# EAGLE design schematic (EAGLE 6.3)
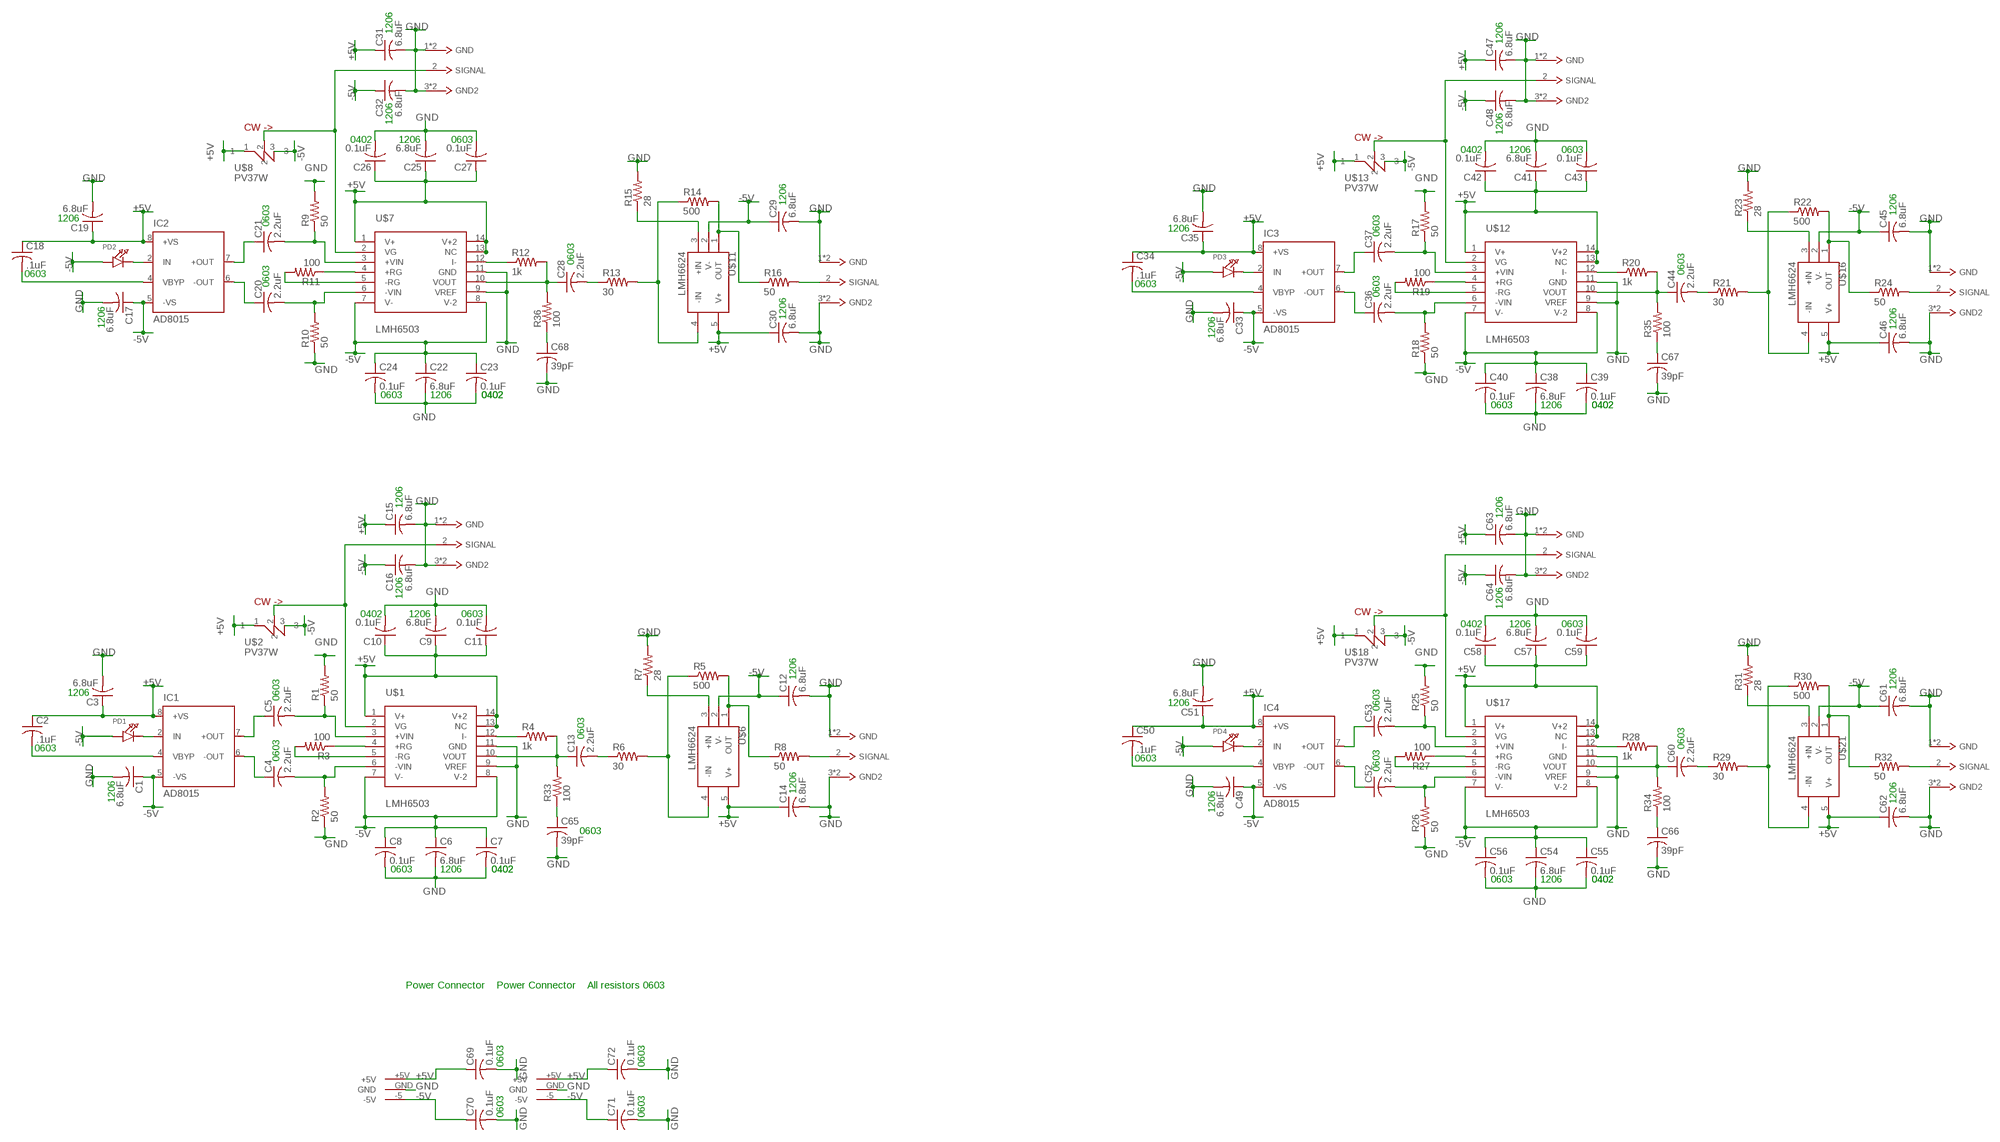
[diagram p0: schematic, sheet 1]

## Parts
C1  6.8uF  C-USC1206  [C1206]
C2  .1uF  C-USC0603  [C0603]
C3  6.8uF  C-USC1206  [C1206]
C4  2.2uF  C-USC0603  [C0603]
C5  2.2uF  C-USC0603  [C0603]
C6  6.8uF  C-USC1206  [C1206]
C7  0.1uF  C-USC0402  [C0402]
C8  0.1uF  C-USC0603  [C0603]
C9  6.8uF  C-USC1206  [C1206]
C10  0.1uF  C-USC0402  [C0402]
C11  0.1uF  C-USC0603  [C0603]
C12  6.8uF  C-USC1206  [C1206]
C13  2.2uF  C-USC0603  [C0603]
C14  6.8uF  C-USC1206  [C1206]
C15  6.8uF  C-USC1206  [C1206]
C16  6.8uF  C-USC1206  [C1206]
C17  6.8uF  C-USC1206  [C1206]
C18  .1uF  C-USC0603  [C0603]
C19  6.8uF  C-USC1206  [C1206]
C20  2.2uF  C-USC0603  [C0603]
C21  2.2uF  C-USC0603  [C0603]
C22  6.8uF  C-USC1206  [C1206]
C23  0.1uF  C-USC0402  [C0402]
C24  0.1uF  C-USC0603  [C0603]
C25  6.8uF  C-USC1206  [C1206]
C26  0.1uF  C-USC0402  [C0402]
C27  0.1uF  C-USC0603  [C0603]
C28  2.2uF  C-USC0603  [C0603]
C29  6.8uF  C-USC1206  [C1206]
C30  6.8uF  C-USC1206  [C1206]
C31  6.8uF  C-USC1206  [C1206]
C32  6.8uF  C-USC1206  [C1206]
C33  6.8uF  C-USC1206  [C1206]
C34  .1uF  C-USC0603  [C0603]
C35  6.8uF  C-USC1206  [C1206]
C36  2.2uF  C-USC0603  [C0603]
C37  2.2uF  C-USC0603  [C0603]
C38  6.8uF  C-USC1206  [C1206]
C39  0.1uF  C-USC0402  [C0402]
C40  0.1uF  C-USC0603  [C0603]
C41  6.8uF  C-USC1206  [C1206]
C42  0.1uF  C-USC0402  [C0402]
C43  0.1uF  C-USC0603  [C0603]
C44  2.2uF  C-USC0603  [C0603]
C45  6.8uF  C-USC1206  [C1206]
C46  6.8uF  C-USC1206  [C1206]
C47  6.8uF  C-USC1206  [C1206]
C48  6.8uF  C-USC1206  [C1206]
C49  6.8uF  C-USC1206  [C1206]
C50  .1uF  C-USC0603  [C0603]
C51  6.8uF  C-USC1206  [C1206]
C52  2.2uF  C-USC0603  [C0603]
C53  2.2uF  C-USC0603  [C0603]
C54  6.8uF  C-USC1206  [C1206]
C55  0.1uF  C-USC0402  [C0402]
C56  0.1uF  C-USC0603  [C0603]
C57  6.8uF  C-USC1206  [C1206]
C58  0.1uF  C-USC0402  [C0402]
C59  0.1uF  C-USC0603  [C0603]
C60  2.2uF  C-USC0603  [C0603]
C61  6.8uF  C-USC1206  [C1206]
C62  6.8uF  C-USC1206  [C1206]
C63  6.8uF  C-USC1206  [C1206]
C64  6.8uF  C-USC1206  [C1206]
C65  39pF  C-USC0603  [C0603]
C66  39pF  C-USC0603  [C0603]
C67  39pF  C-USC0603  [C0603]
C68  39pF  C-USC0603  [C0603]
C69  0.1uF  C-USC0402  [C0402]
C70  0.1uF  C-USC0402  [C0402]
C71  0.1uF  C-USC0402  [C0402]
C72  0.1uF  C-USC0402  [C0402]
IC1  AD8015  [SO8]
IC2  AD8015  [SO8]
IC3  AD8015  [SO8]
IC4  AD8015  [SO8]
PD1  LED1206  [CHIPLED_1206]
PD2  LED1206  [CHIPLED_1206]
PD3  LED1206  [CHIPLED_1206]
PD4  LED1206  [CHIPLED_1206]
R1  50  R-US_R0603  [R0603]
R2  50  R-US_R0603  [R0603]
R3  100  R-US_R0603  [R0603]
R4  1k  R-US_R0603  [R0603]
R5  500  R-US_R0603  [R0603]
R6  30  R-US_R0603  [R0603]
R7  28  R-US_R0603  [R0603]
R8  50  R-US_R0603  [R0603]
R9  50  R-US_R0603  [R0603]
R10  50  R-US_R0603  [R0603]
R11  100  R-US_R0603  [R0603]
R12  1k  R-US_R0603  [R0603]
R13  30  R-US_R0603  [R0603]
R14  500  R-US_R0603  [R0603]
R15  28  R-US_R0603  [R0603]
R16  50  R-US_R0603  [R0603]
R17  50  R-US_R0603  [R0603]
R18  50  R-US_R0603  [R0603]
R19  100  R-US_R0603  [R0603]
R20  1k  R-US_R0603  [R0603]
R21  30  R-US_R0603  [R0603]
R22  500  R-US_R0603  [R0603]
R23  28  R-US_R0603  [R0603]
R24  50  R-US_R0603  [R0603]
R25  50  R-US_R0603  [R0603]
R26  50  R-US_R0603  [R0603]
R27  100  R-US_R0603  [R0603]
R28  1k  R-US_R0603  [R0603]
R29  30  R-US_R0603  [R0603]
R30  500  R-US_R0603  [R0603]
R31  28  R-US_R0603  [R0603]
R32  50  R-US_R0603  [R0603]
R33  100  R-US_R0603  [R0603]
R34  100  R-US_R0603  [R0603]
R35  100  R-US_R0603  [R0603]
R36  100  R-US_R0603  [R0603]
U$1  LMH6503  [SOIC14]
U$2  PV37W  [PV37W]
U$3  DIVERSITYPWR  [DIVERSITYPOWER]
U$4  BNCCONN  [BNCPADS]
U$5  BNCCONN  [BNCPADS]
U$6  LMH6624  [SOT-23]
U$7  LMH6503  [SOIC14]
U$8  PV37W  [PV37W]
U$9  BNCCONN  [BNCPADS]
U$10  BNCCONN  [BNCPADS]
U$11  LMH6624  [SOT-23]
U$12  LMH6503  [SOIC14]
U$13  PV37W  [PV37W]
U$14  BNCCONN  [BNCPADS]
U$15  BNCCONN  [BNCPADS]
U$16  LMH6624  [SOT-23]
U$17  LMH6503  [SOIC14]
U$18  PV37W  [PV37W]
U$19  BNCCONN  [BNCPADS]
U$20  BNCCONN  [BNCPADS]
U$21  LMH6624  [SOT-23]
U$22  DIVERSITYPWR  [DIVERSITYPOWER]

## Nets
+5V: C2.1 C3.1 C9.1 C10.1 C11.1 C14.1 C15.1 C18.1 C19.1 C25.1 C26.1 C27.1 C30.1 C31.1 C34.1 C35.1 C41.1 C42.1 C43.1 C46.1 C47.1 C50.1 C51.1 C57.1 C58.1 C59.1 C62.1 C63.1 C69.1 C72.1 IC1.8(+VS) IC2.8(+VS) IC3.8(+VS) IC4.8(+VS) U$1.1(V+) U$1.13(NC) U$1.14(V+2) U$2.1 U$3.+5V U$6.5(V+) U$7.1(V+) U$7.13(NC) U$7.14(V+2) U$8.1 U$11.5(V+) U$12.1(V+) U$12.13(NC) U$12.14(V+2) U$13.1 U$16.5(V+) U$17.1(V+) U$17.13(NC) U$17.14(V+2) U$18.1 U$21.5(V+) U$22.+5V
-5V: C1.1 C6.1 C7.1 C8.1 C12.1 C16.1 C17.1 C22.1 C23.1 C24.1 C29.1 C32.1 C33.1 C38.1 C39.1 C40.1 C45.1 C48.1 C49.1 C54.1 C55.1 C56.1 C61.1 C64.1 C70.1 C71.1 IC1.5(-VS) IC2.5(-VS) IC3.5(-VS) IC4.5(-VS) PD1.A PD2.A PD3.A PD4.A U$1.7(V-) U$1.8(V-2) U$2.3 U$3.-5(-5V) U$6.2(V-) U$7.7(V-) U$7.8(V-2) U$8.3 U$11.2(V-) U$12.7(V-) U$12.8(V-2) U$13.3 U$16.2(V-) U$17.7(V-) U$17.8(V-2) U$18.3 U$21.2(V-) U$22.-5(-5V)
GND: C1.2 C3.2 C6.2 C7.2 C8.2 C9.2 C10.2 C11.2 C12.2 C14.2 C15.2 C16.2 C17.2 C19.2 C22.2 C23.2 C24.2 C25.2 C26.2 C27.2 C29.2 C30.2 C31.2 C32.2 C33.2 C35.2 C38.2 C39.2 C40.2 C41.2 C42.2 C43.2 C45.2 C46.2 C47.2 C48.2 C49.2 C51.2 C54.2 C55.2 C56.2 C57.2 C58.2 C59.2 C61.2 C62.2 C63.2 C64.2 C65.2 C66.2 C67.2 C68.2 C69.2 C70.2 C71.2 C72.2 R1.2 R2.1 R7.2 R9.2 R10.1 R15.2 R17.2 R18.1 R23.2 R25.2 R26.1 R31.2 U$1.9(VREF) U$1.11(GND) U$3.GND U$4.1(GND) U$4.3(GND2) U$4.4(GND) U$4.5(GND2) U$5.1(GND) U$5.3(GND2) U$5.4(GND) U$5.5(GND2) U$7.9(VREF) U$7.11(GND) U$9.1(GND) U$9.3(GND2) U$9.4(GND) U$9.5(GND2) U$10.1(GND) U$10.3(GND2) U$10.4(GND) U$10.5(GND2) U$12.9(VREF) U$12.11(GND) U$14.1(GND) U$14.3(GND2) U$14.4(GND) U$14.5(GND2) U$15.1(GND) U$15.3(GND2) U$15.4(GND) U$15.5(GND2) U$17.9(VREF) U$17.11(GND) U$19.1(GND) U$19.3(GND2) U$19.4(GND) U$19.5(GND2) U$20.1(GND) U$20.3(GND2) U$20.4(GND) U$20.5(GND2) U$22.GND
N$1: IC1.2(IN) PD1.C
N$2: C5.1 IC1.7(+OUT)
N$3: C2.2 IC1.4(VBYP)
N$4: C4.1 IC1.6(-OUT)
N$5: C4.2 R2.2 U$1.6(-VIN)
N$6: C5.2 R1.1 U$1.3(+VIN)
N$7: R3.1 U$1.4(+RG)
N$8: R3.2 U$1.5(-RG)
N$9: R4.1 U$1.12(I-)
N$10: C13.1 R4.2 R33.2 U$1.10(VOUT)
N$11: R5.1 R6.2 U$6.4(-IN)
N$12: C13.2 R6.1
N$13: U$1.2(VG) U$2.2 U$4.2(SIGNAL)
N$14: R8.2 U$5.2(SIGNAL)
N$15: R7.1 U$6.3(+IN)
N$16: R5.2 R8.1 U$6.1(OUT)
N$25: C18.2 IC2.4(VBYP)
N$26: IC2.2(IN) PD2.C
N$27: C21.1 IC2.7(+OUT)
N$28: C20.1 IC2.6(-OUT)
N$29: C20.2 R10.2 U$7.6(-VIN)
N$30: C21.2 R9.1 U$7.3(+VIN)
N$31: R11.1 U$7.4(+RG)
N$32: R11.2 U$7.5(-RG)
N$33: R12.1 U$7.12(I-)
N$34: C28.1 R12.2 R36.2 U$7.10(VOUT)
N$35: C28.2 R13.1
N$36: U$7.2(VG) U$8.2 U$9.2(SIGNAL)
N$37: R13.2 R14.1 U$11.4(-IN)
N$38: R15.1 U$11.3(+IN)
N$39: R14.2 R16.1 U$11.1(OUT)
N$40: R16.2 U$10.2(SIGNAL)
N$47: C34.2 IC3.4(VBYP)
N$48: IC3.2(IN) PD3.C
N$49: C37.1 IC3.7(+OUT)
N$50: C36.1 IC3.6(-OUT)
N$51: C36.2 R18.2 U$12.6(-VIN)
N$52: C37.2 R17.1 U$12.3(+VIN)
N$53: R19.1 U$12.4(+RG)
N$54: R19.2 U$12.5(-RG)
N$55: R20.1 U$12.12(I-)
N$56: C44.1 R20.2 R35.2 U$12.10(VOUT)
N$57: C44.2 R21.1
N$58: U$12.2(VG) U$13.2 U$14.2(SIGNAL)
N$59: R21.2 R22.1 U$16.4(-IN)
N$60: R23.1 U$16.3(+IN)
N$61: R22.2 R24.1 U$16.1(OUT)
N$62: R24.2 U$15.2(SIGNAL)
N$69: C50.2 IC4.4(VBYP)
N$70: IC4.2(IN) PD4.C
N$71: C53.1 IC4.7(+OUT)
N$72: C52.1 IC4.6(-OUT)
N$73: C52.2 R26.2 U$17.6(-VIN)
N$74: C53.2 R25.1 U$17.3(+VIN)
N$75: R27.1 U$17.4(+RG)
N$76: R27.2 U$17.5(-RG)
N$77: R28.1 U$17.12(I-)
N$78: C60.1 R28.2 R34.2 U$17.10(VOUT)
N$79: C60.2 R29.1
N$80: U$17.2(VG) U$18.2 U$19.2(SIGNAL)
N$81: R29.2 R30.1 U$21.4(-IN)
N$82: R31.1 U$21.3(+IN)
N$83: R30.2 R32.1 U$21.1(OUT)
N$84: R32.2 U$20.2(SIGNAL)
N$91: C65.1 R33.1
N$93: C66.1 R34.1
N$95: C67.1 R35.1
N$97: C68.1 R36.1

## Notes on the sheet
- 1206
- 1206
- 1206
- 1206
- 0402 | 1206 | 0603
- 0402 | 1206 | 0603
- 1206
- 1206
- 1206
- 0603
- 1206
- 0603
- 0603
- 0603
- 0603
- 0603
- 0603
- 0603
- 1206
- 1206
- 1206
- 1206
- 0603 | 1206 | 0402 | 0402
- 0603 | 1206 | 0402 | 0402
- 1206
- 1206
- 1206
- 1206
- 0402 | 1206 | 0603
- 0402 | 1206 | 0603
- 1206
- 1206
- 1206
- 0603
- 1206
- 0603
- 0603
- 0603
- 0603
- 0603
- 0603
- 0603
- 1206
- 1206
- 1206
- 1206
- 0603
- 0603 | 1206 | 0402 | 0402
- 0603 | 1206 | 0402 | 0402
- Power Connector | Power Connector | All resistors 0603
- 0603 | 0603
- 0603 | 0603

## Library data of the parts
C1-C72 = rcl:C-US: CAPACITOR, American symbol
IC1-IC4 = analog-devices:AD8015: Wideband/Differential Output Transimpedance Amplifier Source: http://www.analog.com/static/imported-files/data_sheets/AD8015.pdf; MPN: AD8015ARZ; OC_FARNELL: 1464812; OC_NEWARK: 19M8870
PD1-PD4 = microbuilder:LED: LED 0603 - 0603 Surface Mount Package 2mA: Green LED - Low Power (3.9mcd, 2ma, 1.7Vf) - Digikey: 475-2709-2-ND Orange LED - Low Power (9.8mcd, 2ma, 1.8Vf) - Digikey: 475-1194-2-ND Red LED - Low Power (5mcd, 2ma, 1.8Vf) - Digikey: 475-1195-2-ND Yellow LED - Low Power (7mcd, 2ma, 1.8Vf) - Digikey: 475-1196-2-ND 5mA: Blue LED - Low Power (17mcd, 5ma, 2.9Vf) - Digikey: LNJ937W8CRACT-ND 0805 - 0805 Surface Mount Package 2mA: Red LED (8.8mcd, 2mA, 1.8Vf, Clear) - Low Power [Digikey: 475-2510-1-ND] Green LED (5mcd, 2mA, 1.8Vf, Clear) - Low Power [Digikey: 475-2730-1-ND] Yellow LED (11.3mcd, 2mA, 1.8Vf, Clear) - Low Power [Digikey: 475-2555-1-ND] 20mA: Red LED (104mcd, 20mA, Diffused) - LS R976 [Digikey: 475-1278-6-ND] Red LED (12mcd, 20mA, 2.0Vf, Clear) - APT2012EC [Digikey: 754-1128-1-ND] Green LED (15mcd, 20mA, 2.2Vf, Clear) - APT2012GC [Digikey: 754-1131-1-ND] Orange LED (160mcd, 20mA, 2.1Vf, Clear) - APT2012SECK [Digikey: 754-1130-1-ND] 1206 - 1206 Surface Mount Package Green LED (26mcd, 20mA, Diffused) - LG N971 [Digikey: 475-1407-6-ND] Red LED (15mcd, 20mA, Diffused) - LH N974 [Digikey: 475-1416-6-ND]
R1-R36 = rcl:R-US_: RESISTOR, American symbol
U$1 U$7 U$12 U$17 = 12-ChannelEMG:LMH6503
U$2 U$8 U$13 U$18 = 12-ChannelEMG:PV37W
U$3 U$22 = 12-ChannelEMG:DIVERSITYPWR
U$4 U$5 U$9 U$10 U$14 U$15 U$19 U$20 = 12-ChannelEMG:BNCCONN
U$6 U$11 U$16 U$21 = 12-ChannelEMG:LMH6624

## Board
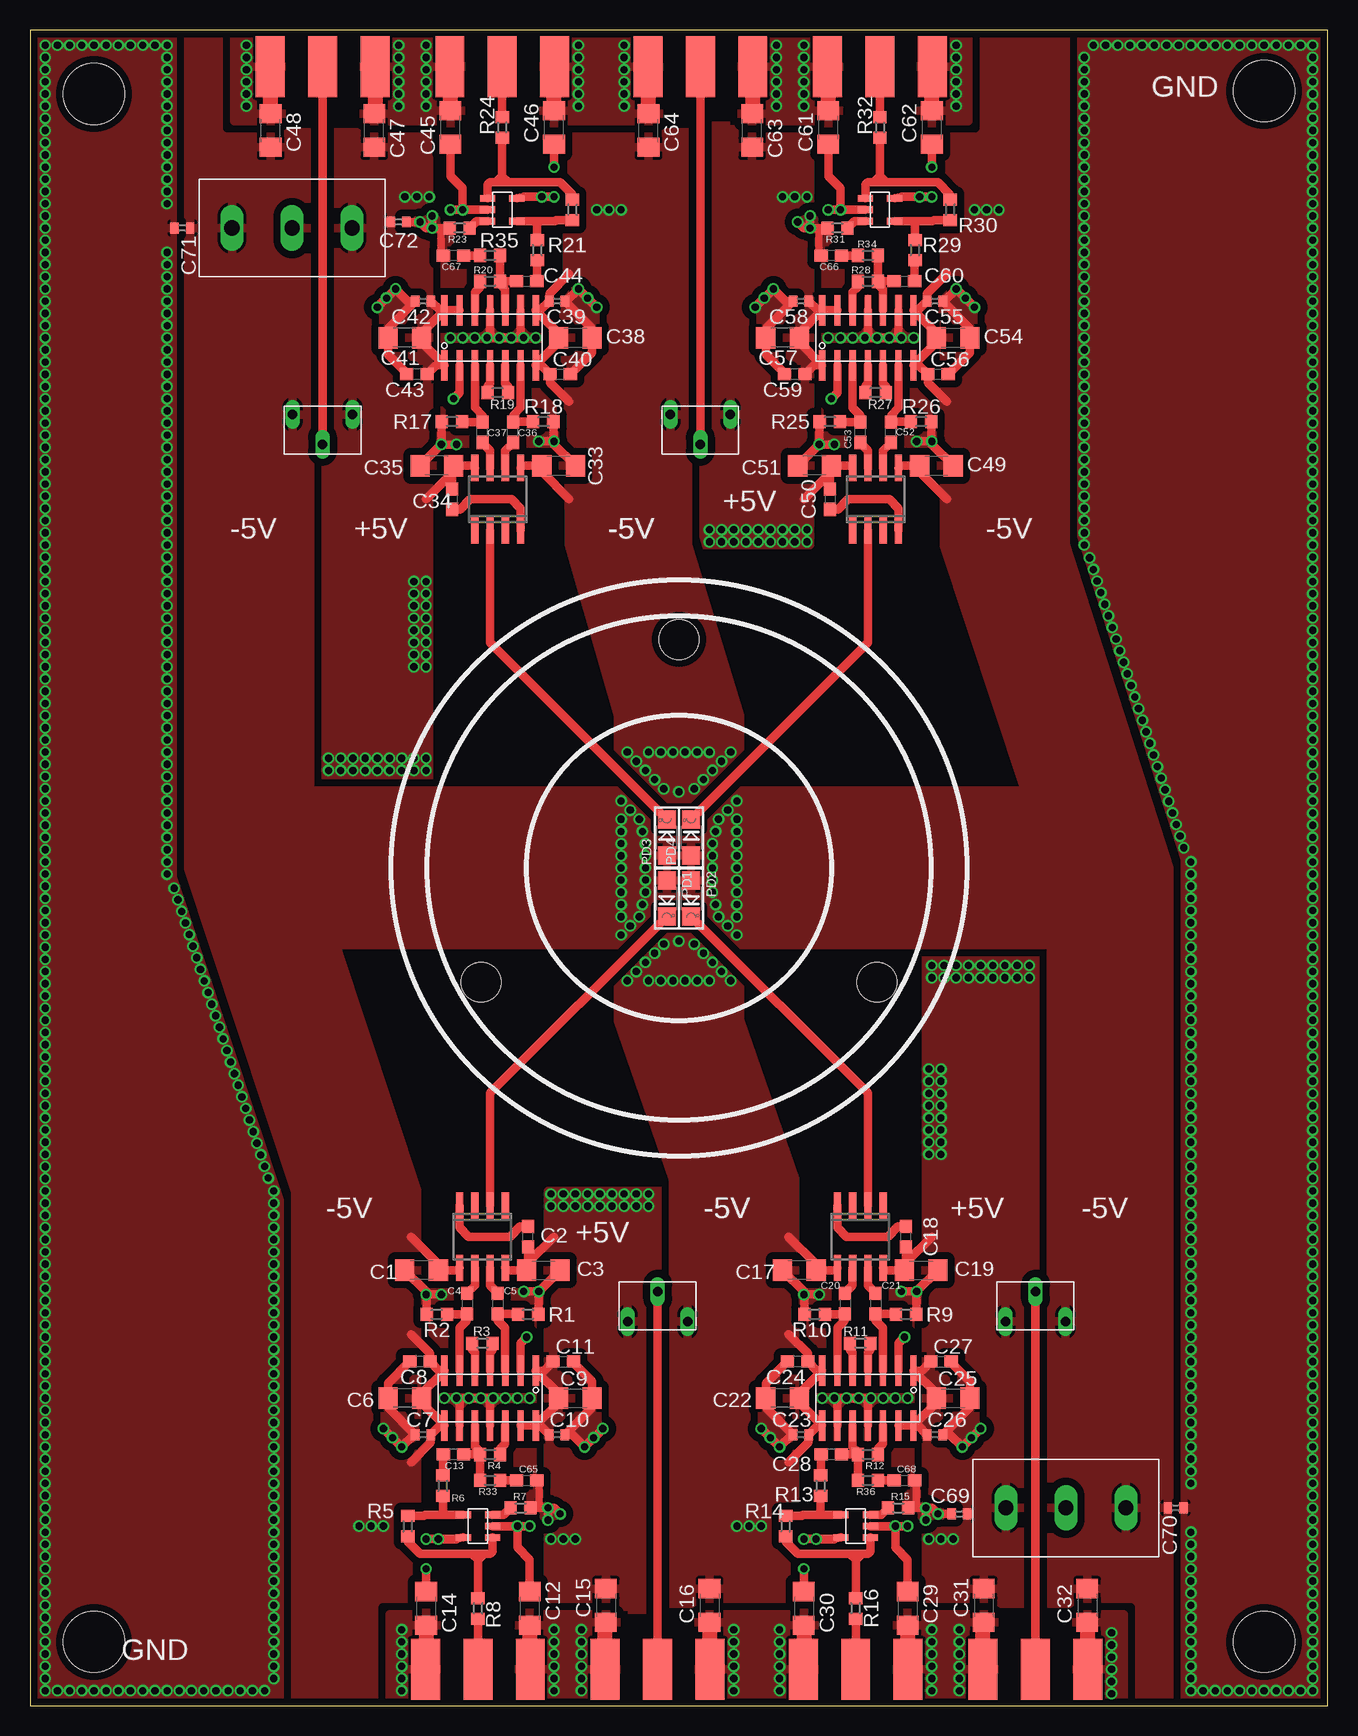
[diagram p1: board, top side]
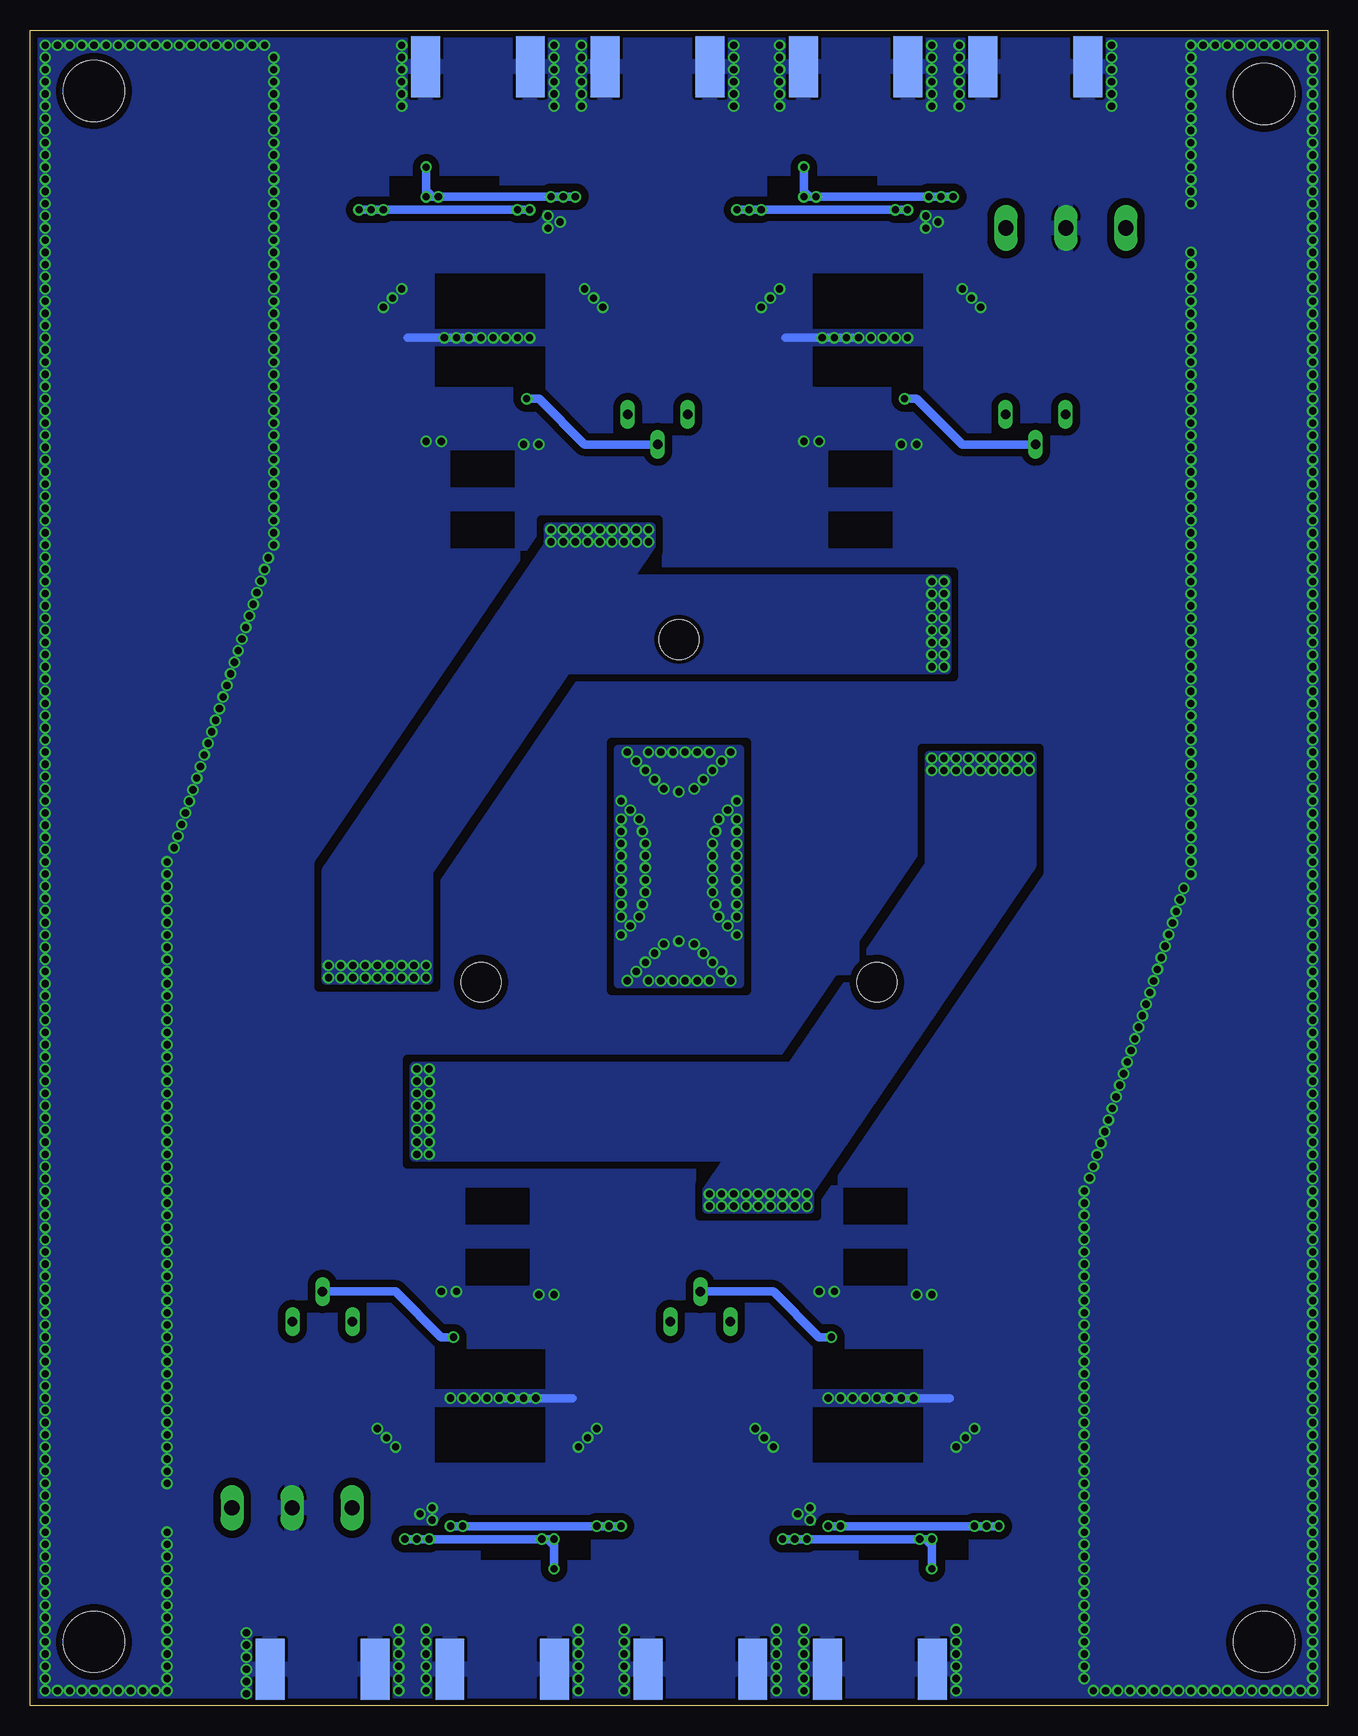
[diagram p2: board, bottom side, seen from below]

Size 108.2 x 139.7 mm. Coordinates in mm from the lower left corner, seen from the top.
Outline: 0,0 108.2,0 108.2,139.7 0,139.7 0,0
Copper layers (1*16): Top 0.0356mm / dielectric 1.5011mm / Bottom 0.0356mm
Design rules "LaenPCBOrder": minimum track width 6mil, minimum drill 13mil, track to track 6mil, track to pad 6mil, pad to pad 6mil, via to via 6mil, smd to smd 6mil, copper to edge 15mil, drill to drill 6mil, minimum pad ring 7mil, minimum via ring 7mil, stop-mask expansion 4mil, vias tented up to drill 0mil, thermal gap 10mil
Holes 3.3 mm at 54.1,88.9 70.6,60.33 37.6,60.33
Holes 5.08 mm at 5.33,5.33 102.87,5.33 102.87,134.62 5.33,134.37

### Footprints (pad centres in the part's own frame; a part is rotated, then mirrored left to right if it is on the bottom)
C1206 = smd 1.6 x 1.8: 1 -1.4,0; 2 1.4,0
C0603 = smd 1.1 x 1: 1 -0.85,0; 2 0.85,0
C0402 = smd 0.7 x 0.9: 1 -0.65,0; 2 0.65,0
SO8 = smd 0.6 x 2.2: 1 -1.905,-2.6; 2 -0.635,-2.6; 3 0.635,-2.6; 4 1.905,-2.6; 5 1.905,2.6; 6 0.635,2.6; 7 -0.635,2.6; 8 -1.905,2.6
CHIPLED_1206 = smd 1.5 x 1.5: A 0,-1.496; C 0,1.496
R0603 = smd 1 x 1.1: 1 -0.85,0; 2 0.85,0
SOIC14 = smd 2.54 x 0.508: 1 -2.286,3.81; 2 -2.286,2.54; 3 -2.286,1.27; 4 -2.286,0; 5 -2.286,-1.27; 6 -2.286,-2.54; 7 -2.286,-3.81; 8 2.286,-3.81; 9 2.286,-2.54; 10 2.286,-1.27; 11 2.286,0; 12 2.286,1.27; 13 2.286,2.54; 14 2.286,3.81
PV37W = drill 0.8 long: 1 -2.5,-2.5; 2 0,0; 3 2.5,-2.5
DIVERSITYPOWER = drill 1.27 long: +5V 5.004,0; -5 -5.004,0; GND 0,0
BNCPADS = smd 2.413 x 5.08: 1 -4.369,0; 2 0,0; 3 4.369,0 | smd 2.413 x 5.08 bottom: 4 -4.369,0; 5 4.369,0
SOT-23 = smd 0.559 x 1.27: 1 -0.95,-1.219; 2 0,-1.219; 3 0.95,-1.219; 4 0.95,1.219; 5 -0.95,1.219

### Placement (x,y rotation side)
C1  32.64,36.32 180 top
C2  41.53,39.12 90 top
C3  42.8,36.32 0 top
C4  36.45,33.53 270 top
C5  38.99,33.53 270 top
C6  31.24,25.65 180 top
C7  32.77,22.61 180 top
C8  32.51,28.7 180 top
C9  45.47,25.65 0 top
C10  43.94,22.61 0 top
C11  44.45,28.7 0 top
C12  41.66,8.13 270 top
C13  35.31,20.95 180 top
C14  33.02,8.13 270 top
C15  48.01,8.38 270 top
C16  56.64,8.38 270 top
C17  64.14,36.32 180 top
C18  73.03,39.12 90 top
C19  74.3,36.32 0 top
C20  67.94,33.53 270 top
C21  70.48,33.53 270 top
C22  62.74,25.65 180 top
C23  64.26,22.61 180 top
C24  64.01,28.7 180 top
C25  76.96,25.65 0 top
C26  75.44,22.61 0 top
C27  75.95,28.7 0 top
C28  66.8,20.95 180 top
C29  73.15,8.13 270 top
C30  64.52,8.13 270 top
C31  79.5,8.38 270 top
C32  88.14,8.38 270 top
C33  44.07,103.38 0 top
C34  35.18,100.58 270 top
C35  33.91,103.38 180 top
C36  40.26,106.17 90 top
C37  37.72,106.17 90 top
C38  45.47,114.05 0 top
C39  43.94,117.09 0 top
C40  44.2,111 0 top
C41  31.24,114.05 180 top
C42  32.77,117.09 180 top
C43  32.26,111 180 top
C44  41.4,118.75 0 top
C45  35.05,131.57 90 top
C46  43.69,131.57 90 top
C47  28.7,131.32 90 top
C48  20.07,131.32 90 top
C49  75.56,103.38 0 top
C50  66.67,100.58 270 top
C51  65.41,103.38 180 top
C52  71.75,106.17 90 top
C53  69.22,106.17 90 top
C54  76.96,114.05 0 top
C55  75.44,117.09 0 top
C56  75.69,111 0 top
C57  62.74,114.05 180 top
C58  64.26,117.09 180 top
C59  63.75,111 180 top
C60  72.9,118.75 0 top
C61  66.55,131.57 90 top
C62  75.18,131.57 90 top
C63  60.2,131.32 90 top
C64  51.56,131.32 90 top
C65  41.4,18.8 0 top
C66  66.8,120.9 180 top
C67  35.31,120.9 180 top
C68  72.9,18.8 0 top
C69  77.47,16 180 top
C70  95.5,16.51 0 top
C71  12.7,123.19 180 top
C72  30.73,123.7 0 top
IC1  37.72,39.12 180 top
IC2  69.22,39.12 180 top
IC3  38.99,100.58 0 top
IC4  70.48,100.58 0 top
PD1  53.09,67.31 180 top
PD2  55.12,67.31 180 top
PD3  53.09,72.39 0 top
PD4  55.12,72.39 0 top
R1  41.53,32.64 0 top
R2  33.91,32.64 0 top
R3  37.72,30.23 180 top
R4  38.35,20.95 180 top
R5  31.5,14.99 270 top
R6  34.42,18.35 270 top
R7  40.89,16.51 0 top
R8  37.34,8.13 270 top
R9  73.03,32.64 0 top
R10  65.41,32.64 0 top
R11  69.22,30.23 180 top
R12  69.85,20.95 180 top
R13  65.91,18.35 270 top
R14  62.99,14.99 270 top
R15  72.39,16.51 0 top
R16  68.83,8.13 270 top
R17  35.18,107.06 180 top
R18  42.8,107.06 180 top
R19  38.99,109.47 0 top
R20  38.35,118.75 0 top
R21  42.29,121.35 90 top
R22  45.21,124.71 90 top
R23  35.81,123.19 180 top
R24  39.37,131.57 90 top
R25  66.67,107.06 180 top
R26  74.3,107.06 180 top
R27  70.48,109.47 0 top
R28  69.85,118.75 0 top
R29  73.79,121.35 90 top
R30  76.71,124.71 90 top
R31  67.31,123.19 180 top
R32  70.87,131.57 90 top
R33  38.35,18.8 180 top
R34  69.85,120.9 0 top
R35  38.35,120.9 0 top
R36  69.85,18.8 180 top
U$1  38.35,25.65 270 top
U$2  52.32,34.54 0 top
U$3  86.36,16.51 180 top
U$4  52.32,3.05 0 top
U$5  37.34,3.05 0 top
U$6  37.34,14.99 90 top
U$7  69.85,25.65 270 top
U$8  83.82,34.54 0 top
U$9  83.82,3.05 0 top
U$10  68.83,3.05 0 top
U$11  68.83,14.99 90 top
U$12  38.35,114.05 90 top
U$13  24.38,105.16 180 top
U$14  24.38,136.65 180 top
U$15  39.37,136.65 180 top
U$16  39.37,124.71 270 top
U$17  69.85,114.05 90 top
U$18  55.88,105.16 180 top
U$19  55.88,136.65 180 top
U$20  70.87,136.65 180 top
U$21  70.87,124.71 270 top
U$22  21.84,123.19 0 top

### Tracks (layer width: path | path; a pad name or v marks a point on that pad's centre or on a via)
+5V  (via drill 0.6)
  Top 0.711: C11.1 42.84,27.94 U$1.1 44.07,26.04 C9.1 44.07,25.27 U$1.14 | U$1.14 42.53,23.37 C10.1 | U$1.14 U$1.13 | IC1.8 39.82,36.32 C3.1 41.53,36.45 | C2.1 41.53,36.96 | 41.53,36.45 41.53,35.94 | 41.53,36.45 41.53,36.96 | 41.53,36.96 43.69,39.12 | U$6.5 35.43,13.91 | 35.43,13.91 33.21,13.91 v33.02,13.91 | v33.02,11.43 C14.1 | v34.04,13.91 35.56,13.91 35.43,13.91 | C27.1 74.33,27.94 U$7.1 75.56,26.04 C25.1 75.56,25.27 U$7.14 | U$7.14 74.03,23.37 C26.1 | U$7.14 U$7.13 | IC2.8 71.31,36.32 C19.1 73.03,36.45 | C18.1 73.03,36.96 | 73.03,36.45 73.03,35.94 | 73.03,36.45 73.03,36.96 | 73.03,36.96 75.18,39.12 | U$11.5 66.93,13.91 | 66.93,13.91 64.71,13.91 v64.52,13.91 | v64.52,11.43 C30.1 | v65.53,13.91 67.05,13.91 66.93,13.91 | C43.1 33.87,111.76 U$12.1 32.64,113.66 C41.1 32.64,114.43 U$12.14 | U$12.14 34.18,116.33 C42.1 | U$12.14 U$12.13 | IC3.8 36.89,103.38 C35.1 35.18,103.25 | C34.1 35.18,102.74 | 35.18,103.25 35.18,103.76 | 35.18,103.25 35.18,102.74 | 35.18,102.74 33.02,100.58 | U$16.5 41.27,125.79 | 41.27,125.79 43.49,125.79 v43.69,125.79 | v43.69,128.27 C46.1 | v42.67,125.79 41.15,125.79 41.27,125.79 | C59.1 65.37,111.76 U$17.1 64.14,113.66 C57.1 64.14,114.43 U$17.14 | U$17.14 65.67,116.33 C58.1 | U$17.14 U$17.13 | IC4.8 68.39,103.38 C51.1 66.67,103.25 | C50.1 66.67,102.74 | 66.67,103.25 66.67,103.76 | 66.67,103.25 66.67,102.74 | 66.67,102.74 64.52,100.58 | U$21.5 72.77,125.79 | 72.77,125.79 74.99,125.79 v75.18,125.79 | v75.18,128.27 C62.1 | v74.17,125.79 72.65,125.79 72.77,125.79
  Bottom 0.711: 33.02,13.46 v33.02,13.91 33.53,13.91 | 33.02,13.46 v33.02,11.43 | 33.53,13.91 v43.43,13.91 v44.45,13.91 v45.47,13.91 | 33.02,13.46 33.08,13.46 33.53,13.91 | 64.52,13.46 v64.52,13.91 65.02,13.91 | 64.52,13.46 v64.52,11.43 | 65.02,13.91 v74.93,13.91 v75.95,13.91 v76.96,13.91 | 64.52,13.46 64.58,13.46 65.02,13.91 | 43.69,126.24 v43.69,125.79 43.18,125.79 | 43.69,126.24 v43.69,128.27 | 43.18,125.79 v33.27,125.79 v32.26,125.79 v31.24,125.79 | 43.69,126.24 43.62,126.24 43.18,125.79 | 75.18,126.24 v75.18,125.79 74.68,125.79 | 75.18,126.24 v75.18,128.27 | 74.68,125.79 v64.77,125.79 v63.75,125.79 v62.74,125.79 | 75.18,126.24 75.12,126.24 74.68,125.79
  other vias: 43.43,42.67 44.45,42.67 45.47,42.67 46.48,42.67 47.5,42.67 48.51,42.67 49.53,42.67 50.55,42.67 51.56,42.67 24.89,77.98 25.91,77.98 26.92,77.98 27.94,77.98 28.96,77.98 29.97,77.98 30.99,77.98 32,77.98 33.02,77.98 56.64,97.03 57.66,97.03 58.67,97.03 59.69,97.03 60.71,97.03 61.72,97.03 62.74,97.03 63.75,97.03 64.77,97.03 83.31,61.72 82.3,61.72 81.28,61.72 80.26,61.72 79.25,61.72 78.23,61.72 77.22,61.72 76.2,61.72 75.18,61.72 33.02,86.61 33.02,87.63 33.02,88.65 33.02,89.66 33.02,90.68 33.02,91.69 33.02,92.71 33.02,93.73 74.93,53.09 74.93,52.07 74.93,51.05 74.93,50.04 74.93,49.02 74.93,48.01 74.93,46.99 74.93,45.97 32,86.61 32,87.63 32,88.65 32,89.66 32,90.68 32,91.69 32,92.71 32,93.73 75.95,45.97 75.95,46.99 75.95,48.01 75.95,49.02 75.95,50.04 75.95,51.05 75.95,52.07 75.95,53.09 83.31,60.71 82.3,60.71 81.28,60.71 80.26,60.71 79.25,60.71 78.23,60.71 77.22,60.71 76.2,60.71 75.18,60.71 33.02,78.99 32,78.99 30.99,78.99 29.97,78.99 28.96,78.99 27.94,78.99 26.92,78.99 25.91,78.99 24.89,78.99 51.56,41.66 50.55,41.66 49.53,41.66 48.51,41.66 47.5,41.66 46.48,41.66 45.47,41.66 44.45,41.66 43.43,41.66 64.77,98.04 63.75,98.04 62.74,98.04 61.72,98.04 60.71,98.04 59.69,98.04 58.67,98.04 57.66,98.04 56.64,98.04
  pour Top (isolate 0.61, rank 3): 43.18,7.62 53.34,7.62 53.34,42.93 43.18,42.93
  pour Top (isolate 0.61, rank 3): 74.68,7.62 84.84,7.62 84.84,62.74 74.68,62.74
  pour Top (isolate 0.61, rank 3): 33.27,132.08 23.37,132.08 23.37,76.96 33.27,76.96
  pour Top (isolate 0.61, rank 3): 65.02,132.08 54.86,132.08 54.86,96.77 65.02,96.77
  pour Bottom (isolate 0.61): 43.18,42.93 24.64,70.1 24.64,79.25 33.27,79.25 33.27,70.1 51.82,42.93 51.82,41.4 43.18,41.4
  pour Bottom (isolate 0.61): 65.02,96.77 83.57,69.6 83.57,60.45 74.93,60.45 74.93,69.6 56.39,96.77 56.39,98.3 65.02,98.3
  pour Bottom: 31.75,93.98 31.75,86.36 63.75,86.36 63.75,93.98
  pour Bottom: 76.2,45.72 76.2,53.34 44.2,53.34 44.2,45.72
-5V  (via drill 0.6)
  Top 0.711: IC1.5 35.62,36.32 C1.1 34.04,36.83 31.75,39.12 | 31.75,30.99 33.36,29.38 C8.1 34.12,27.94 U$1.7 32.64,26.04 C6.1 32.64,25.27 U$1.8 34.18,23.37 C7.1 33.42,21.99 31.75,20.32 | 39.62,14.99 v40.64,14.99 | v40.64,14.99 U$6.2 | v40.64,14.99 v41.66,14.99 | v40.64,14.99 40.64,13.21 41.66,12.19 C12.1 | IC2.5 67.12,36.32 C17.1 65.53,36.83 63.25,39.12 | 63.25,30.99 64.86,29.38 C24.1 65.62,27.94 U$7.7 64.14,26.04 C22.1 64.14,25.27 U$7.8 65.67,23.37 C23.1 64.91,21.99 63.25,20.32 | 71.12,14.99 v72.14,14.99 | v72.14,14.99 U$11.2 | v72.14,14.99 v73.15,14.99 | v72.14,14.99 72.14,13.21 73.15,12.19 C29.1 | IC3.5 41.09,103.38 C33.1 42.67,102.87 44.96,100.58 | 44.96,108.71 43.35,110.32 C40.1 42.58,111.76 U$12.7 44.07,113.66 C38.1 44.07,114.43 U$12.8 42.53,116.33 C39.1 43.29,117.71 44.96,119.38 | 37.08,124.71 v36.07,124.71 | v36.07,124.71 U$16.2 | v36.07,124.71 v35.05,124.71 | v36.07,124.71 36.07,126.49 35.05,127.51 C45.1 | IC4.5 72.58,103.38 C49.1 74.17,102.87 76.45,100.58 | 76.45,108.71 74.84,110.32 C56.1 74.08,111.76 U$17.7 75.56,113.66 C54.1 75.56,114.43 U$17.8 74.03,116.33 C55.1 74.79,117.71 76.45,119.38 | 68.58,124.71 v67.56,124.71 | v67.56,124.71 U$21.2 | v67.56,124.71 v66.55,124.71 | v67.56,124.71 67.56,126.49 66.55,127.51 C61.1
  Bottom 0.711: v41.66,14.99 v29.46,14.99 v28.45,14.99 v27.43,14.99 | v73.15,14.99 v60.96,14.99 v59.94,14.99 v58.93,14.99 | v35.05,124.71 v47.24,124.71 v48.26,124.71 v49.28,124.71 | v66.55,124.71 v78.74,124.71 v79.76,124.71 v80.77,124.71
  other vias: 49.78,60.45 50.55,61.21 51.31,61.98 52.07,62.74 52.83,63.5 54.1,63.75 55.37,63.5 56.13,62.74 56.9,61.98 57.66,61.21 58.42,60.45 58.42,79.5 57.66,78.74 56.9,77.98 56.13,77.22 55.37,76.45 54.1,76.2 52.83,76.45 52.07,77.22 51.31,77.98 50.55,78.74 49.78,79.5 49.28,75.44 50.04,74.68 50.8,73.91 51.05,72.9 51.31,71.88 51.31,70.87 51.31,69.85 51.31,68.83 51.31,67.82 51.05,66.8 50.8,65.79 50.04,65.02 49.28,64.26 58.93,64.26 58.17,65.02 57.4,65.79 57.15,66.8 56.9,67.82 56.9,68.83 56.9,69.85 56.9,70.87 56.9,71.88 57.15,72.9 57.4,73.91 58.17,74.68 58.93,75.44 51.56,60.45 52.58,60.45 53.59,60.45 54.61,60.45 55.63,60.45 56.64,60.45 51.56,79.5 52.58,79.5 53.59,79.5 54.61,79.5 55.63,79.5 56.64,79.5 58.93,68.83 58.93,69.85 58.93,70.87 58.93,71.88 58.93,72.9 58.93,73.91 58.93,65.79 58.93,66.8 58.93,67.82 49.28,68.83 49.28,69.85 49.28,70.87 49.28,71.88 49.28,72.9 49.28,73.91 49.28,65.79 49.28,66.8 49.28,67.82
  pour Top (isolate 0.61, rank 2): 53.59,7.62 63.75,7.62 63.75,43.94 59.18,57.15 59.18,82.55 54.86,96.77 54.86,132.08 44.7,132.08 44.96,96.77 49.02,82.55 49.02,57.15 53.59,43.94
  pour Top (isolate 0.61, rank 2): 22.1,0 32.26,0 32.26,42.93 23.37,69.85 23.37,139.19 13.21,139.19 13.21,69.85 22.1,42.93
  pour Top (isolate 0.61, rank 2): 85.09,0.25 95,0.25 95,69.85 86.36,96.77 86.36,139.19 76.2,139.19 76.2,96.77 85.09,69.85
  pour Top (isolate 0.61, rank 2): 85.09,76.45 85.09,63.25 23.37,63.25 23.37,76.45
  pour Bottom: 49.02,79.76 59.18,79.76 59.18,60.2 49.02,60.2
GND  (via drill 0.6)
  Top 0.61: C65.2 42.42,18.8 42.42,16.51 | C68.2 73.91,18.8 73.91,16.51 | C66.2 65.79,120.9 65.79,123.19 | C67.2 34.29,120.9 34.29,123.19
  Top 0.711: v41.15,34.54 v42.42,34.54 | 33.06,34.29 v34.29,34.29 | C11.2 45.3,28.61 46.86,27.05 C9.2 46.87,24.88 C10.2 45.21,22.61 v46.23,21.59 | v46.99,22.35 v46.23,21.59 | v46.23,21.59 v47.75,23.11 | R1.2 42.38,34.5 v42.42,34.54 | v42.42,34.54 C3.2 | v29.46,23.11 v30.23,22.35 v30.99,21.59 32,22.61 C7.2 29.84,24.88 C6.2 29.84,26.88 C8.2 | R2.1 33.06,34.29 | 33.06,34.29 33.06,34.5 C1.2 | U$1.9 35.81,25.4 36.07,25.65 v36.58,25.65 v37.59,25.65 38.1,25.65 38.35,25.4 U$1.11 | R7.2 42.42,16.51 v43.18,16.51 | v43.18,16.51 43.69,16.51 v44.2,16 | v43.18,16.51 v43.18,15.49 | v33.02,34.29 33.06,34.29 | v72.64,34.54 v73.91,34.54 v73.92,34.54 | 64.56,34.29 v65.79,34.29 | C27.2 76.8,28.61 78.36,27.05 C25.2 78.36,24.88 C26.2 76.71,22.61 v77.72,21.59 | v78.49,22.35 v77.72,21.59 | v77.72,21.59 v79.25,23.11 | R9.2 73.88,34.5 v73.92,34.54 | v73.92,34.54 C19.2 | v60.96,23.11 v61.72,22.35 v62.48,21.59 63.5,22.61 C23.2 61.34,24.88 C22.2 61.34,26.88 C24.2 | R10.1 64.56,34.29 | 64.56,34.29 64.56,34.5 C17.2 | U$7.9 67.31,25.4 67.56,25.65 v68.07,25.65 v69.09,25.65 69.6,25.65 69.85,25.4 U$7.11 | R15.2 73.91,16.51 v74.68,16.51 | v74.68,16.51 75.18,16.51 v75.69,16 C69.2 | v74.68,16.51 v74.68,15.49 | v64.52,34.29 64.56,34.29 | v35.56,105.16 v34.29,105.16 | 43.65,105.41 v42.42,105.41 | C43.2 31.41,111.09 29.84,112.65 C41.2 29.84,114.82 C42.2 31.5,117.09 v30.48,118.11 | v29.72,117.35 v30.48,118.11 | v30.48,118.11 v28.96,116.59 | R17.2 34.33,105.2 v34.29,105.16 | v34.29,105.16 C35.2 | v47.24,116.59 v46.48,117.35 v45.72,118.11 44.7,117.09 C39.2 46.87,114.82 C38.2 46.87,112.82 C40.2 | R18.1 43.65,105.41 | 43.65,105.41 43.65,105.2 C33.2 | U$12.9 40.89,114.3 40.64,114.05 v40.13,114.05 v39.12,114.05 38.61,114.05 38.35,114.3 U$12.11
  Top 0.711: R23.2 34.29,123.19 v33.53,123.19 | v33.53,123.19 33.02,123.19 v32.51,123.7 C72.2 | v33.53,123.19 v33.53,124.21 | v43.69,105.41 43.65,105.41 | v67.06,105.16 v65.79,105.16 v65.78,105.16 | 75.14,105.41 v73.91,105.41 | C59.2 62.9,111.09 61.34,112.65 C57.2 61.34,114.82 C58.2 62.99,117.09 v61.98,118.11 | v61.21,117.35 v61.98,118.11 | v61.98,118.11 v60.45,116.59 | R25.2 65.83,105.2 v65.78,105.16 | v65.78,105.16 C51.2 | v78.74,116.59 v77.98,117.35 v77.22,118.11 76.2,117.09 C55.2 78.36,114.82 C54.2 78.36,112.82 C56.2 | R26.1 75.14,105.41 | 75.14,105.41 75.14,105.2 C49.2 | U$17.9 72.39,114.3 72.14,114.05 v71.63,114.05 v70.61,114.05 70.1,114.05 69.85,114.3 U$17.11 | R31.2 65.79,123.19 v65.02,123.19 | v65.02,123.19 64.52,123.19 v64.01,123.7 | v65.02,123.19 v65.02,124.21 | v75.18,105.41 75.14,105.41
  Top 1.27: U$5.4 32.97,4.57 | 32.97,4.57 32.97,5.15 | U$5.5 41.71,4.57 | 41.71,4.57 41.71,5.15 | U$4.4 47.95,6.93 C15.2 | U$4.5 56.69,6.93 C16.2 | C14.2 33.02,4.62 32.97,4.57 | C12.2 41.66,4.62 41.71,4.57 | U$10.4 64.47,4.57 | 64.47,4.57 64.47,5.15 | U$10.5 73.2,4.57 | 73.2,4.57 73.2,5.15 | U$9.4 79.45,6.93 C31.2 | U$9.5 88.19,6.93 C32.2 | C30.2 64.52,4.62 64.47,4.57 | C29.2 73.15,4.62 73.2,4.57 | U$15.4 43.74,135.13 | 43.74,135.13 43.74,134.55 | U$15.5 35,135.13 | 35,135.13 35,134.55 | U$14.4 28.75,132.77 C47.2 | U$14.5 20.02,132.77 C48.2 | C46.2 43.69,135.08 43.74,135.13 | C45.2 35.05,135.08 35,135.13 | U$20.4 75.23,135.13 | 75.23,135.13 75.23,134.55 | U$20.5 66.5,135.13 | 66.5,135.13 66.5,134.55 | U$19.4 60.25,132.77 C63.2 | U$19.5 51.51,132.77 C64.2 | C62.2 75.18,135.08 75.23,135.13 | C61.2 66.55,135.08 66.5,135.13
  Bottom 0.711: v37.59,25.65 v35.56,25.65 v34.54,25.65 31.5,25.65 | v69.09,25.65 v67.06,25.65 v66.04,25.65 62.99,25.65 | v39.12,114.05 v41.15,114.05 v42.16,114.05 45.21,114.05 | v70.61,114.05 v72.64,114.05 v73.66,114.05 76.71,114.05
  other vias: 30.99,1.27 30.99,2.29 30.99,3.3 30.99,4.32 30.99,5.33 43.69,5.33 43.69,4.32 43.69,3.3 43.69,2.29 43.69,1.27 45.97,1.27 45.97,2.29 45.97,3.3 45.97,4.32 45.97,5.33 45.97,6.35 58.67,6.35 58.67,5.33 58.67,4.32 58.67,3.3 58.67,2.29 58.67,1.27 62.48,1.27 62.48,2.29 62.48,3.3 62.48,4.32 62.48,5.33 75.18,5.33 75.18,4.32 75.18,3.3 75.18,2.29 75.18,1.27 77.47,1.27 77.47,2.29 77.47,3.3 77.47,4.32 77.47,5.33 77.47,6.35 90.17,6.1 90.17,5.08 90.17,4.06 90.17,3.05 90.17,2.03 90.17,1.02 45.72,138.43 45.72,137.41 45.72,136.4 45.72,135.38 45.72,134.37 33.02,134.37 33.02,135.38 33.02,136.4 33.02,137.41 33.02,138.43 30.73,138.43 30.73,137.41 30.73,136.4 30.73,135.38 30.73,134.37 30.73,133.35 18.03,133.35 18.03,134.37 18.03,135.38 18.03,136.4 18.03,137.41 18.03,138.43 77.22,138.43 77.22,137.41 77.22,136.4 77.22,135.38 77.22,134.37 64.52,134.37 64.52,135.38 64.52,136.4 64.52,137.41 64.52,138.43 62.23,138.43 62.23,137.41 62.23,136.4 62.23,135.38 62.23,134.37 62.23,133.35 49.53,133.35 49.53,134.37 49.53,135.38 49.53,136.4 49.53,137.41 49.53,138.43 43.69,6.35 30.99,6.35 62.48,6.35 75.18,6.35 33.02,133.35 45.72,133.35 64.52,133.35 77.22,133.35 19.56,1.27 1.27,1.27 1.27,2.29 1.27,3.3 18.54,1.27 17.53,1.27 16.51,1.27 15.49,1.27 14.48,1.27 13.46,1.27 12.45,1.27 11.43,1.27 10.41,1.27 9.4,1.27 8.38,1.27 7.37,1.27 6.35,1.27 5.33,1.27 4.32,1.27 3.3,1.27 2.29,1.27 1.27,23.62 1.27,22.61 1.27,4.32 1.27,21.59 1.27,20.57 1.27,19.56 1.27,18.54 1.27,17.53 1.27,16.51 1.27,15.49 1.27,14.48 1.27,13.46 1.27,12.45 1.27,11.43 1.27,10.41 1.27,9.4 1.27,8.38 1.27,7.37 1.27,6.35 1.27,5.33 1.27,24.64 1.27,25.65 1.27,45.97 1.27,44.96 1.27,26.67 1.27,43.94 1.27,42.93 1.27,41.91 1.27,40.89 1.27,39.88 1.27,38.86 1.27,37.85 1.27,36.83 1.27,35.81 1.27,34.8 1.27,33.78 1.27,32.77 1.27,31.75 1.27,30.73 1.27,29.72 1.27,28.7 1.27,27.69 1.27,46.99 1.27,48.01 1.27,49.02 1.27,69.34 1.27,68.33 1.27,50.04 1.27,67.31 1.27,66.29 1.27,65.28 1.27,64.26 1.27,63.25 1.27,62.23 1.27,61.21 1.27,60.2 1.27,59.18 1.27,58.17 1.27,57.15 1.27,56.13 1.27,55.12 1.27,54.1 1.27,53.09 1.27,52.07 1.27,51.05 1.27,70.36 1.27,71.37 1.27,91.69 1.27,90.68 1.27,72.39 1.27,89.66 1.27,88.65 1.27,87.63 1.27,86.61 1.27,85.6 1.27,84.58 1.27,83.57 1.27,82.55 1.27,81.53 1.27,80.52 1.27,79.5 1.27,78.49 1.27,77.47 1.27,76.45 1.27,75.44 1.27,74.42 1.27,73.41 1.27,100.84 1.27,99.82 1.27,98.81 1.27,97.79 1.27,96.77 1.27,95.76 1.27,94.74 1.27,93.73 1.27,92.71 1.27,101.85 1.27,102.87 1.27,103.89 1.27,124.21 1.27,123.19 1.27,104.9 1.27,122.17 1.27,121.16 1.27,120.14 1.27,119.13 1.27,118.11 1.27,117.09 1.27,116.08 1.27,115.06 1.27,114.05 1.27,113.03 1.27,112.01 1.27,111 1.27,109.98 1.27,108.97 1.27,107.95 1.27,106.93 1.27,105.92 1.27,125.22 1.27,126.24 1.27,127.25 1.27,138.43 1.27,137.41 1.27,136.4 1.27,135.38 1.27,134.37 1.27,133.35 1.27,132.33 1.27,131.32 1.27,130.3 1.27,129.29 1.27,128.27 2.29,138.43 3.3,138.43 4.32,138.43 5.33,138.43 6.35,138.43 7.37,138.43 8.38,138.43 9.4,138.43 10.41,138.43 11.43,138.43 88.65,138.43 106.93,138.43 106.93,137.41 106.93,136.4 89.66,138.43 90.68,138.43 91.69,138.43 92.71,138.43 93.73,138.43 94.74,138.43 95.76,138.43 96.77,138.43 97.79,138.43 98.81,138.43 99.82,138.43 100.84,138.43 101.85,138.43 102.87,138.43 103.89,138.43 104.9,138.43 105.92,138.43 106.93,116.08 106.93,117.09 106.93,135.38 106.93,118.11 106.93,119.13 106.93,120.14 106.93,121.16 106.93,122.17 106.93,123.19 106.93,124.21 106.93,125.22 106.93,126.24 106.93,127.25 106.93,128.27 106.93,129.29 106.93,130.3 106.93,131.32 106.93,132.33 106.93,133.35 106.93,134.37 106.93,115.06 106.93,114.05 106.93,93.73 106.93,94.74 106.93,113.03 106.93,95.76 106.93,96.77 106.93,97.79 106.93,98.81 106.93,99.82 106.93,100.84 106.93,101.85 106.93,102.87 106.93,103.89 106.93,104.9 106.93,105.92 106.93,106.93 106.93,107.95 106.93,108.97 106.93,109.98 106.93,111 106.93,112.01 106.93,92.71 106.93,91.69 106.93,90.68 106.93,70.36 106.93,71.37 106.93,89.66 106.93,72.39 106.93,73.41 106.93,74.42 106.93,75.44 106.93,76.45 106.93,77.47 106.93,78.49 106.93,79.5 106.93,80.52 106.93,81.53 106.93,82.55 106.93,83.57 106.93,84.58 106.93,85.6 106.93,86.61 106.93,87.63 106.93,88.65 106.93,69.34 106.93,68.33 106.93,48.01 106.93,49.02 106.93,67.31 106.93,50.04 106.93,51.05 106.93,52.07 106.93,53.09 106.93,54.1 106.93,55.12 106.93,56.13 106.93,57.15 106.93,58.17 106.93,59.18 106.93,60.2 106.93,61.21 106.93,62.23 106.93,63.25 106.93,64.26 106.93,65.28 106.93,66.29 106.93,38.86 106.93,39.88 106.93,40.89 106.93,41.91 106.93,42.93 106.93,43.94 106.93,44.96 106.93,45.97 106.93,46.99 106.93,37.85 106.93,36.83 106.93,35.81 106.93,15.49 106.93,16.51 106.93,34.8 106.93,17.53 106.93,18.54 106.93,19.56 106.93,20.57 106.93,21.59 106.93,22.61 106.93,23.62 106.93,24.64 106.93,25.65 106.93,26.67 106.93,27.69 106.93,28.7 106.93,29.72 106.93,30.73 106.93,31.75 106.93,32.77 106.93,33.78 106.93,14.48 106.93,13.46 106.93,12.45 106.93,1.27 106.93,2.29 106.93,3.3 106.93,4.32 106.93,5.33 106.93,6.35 106.93,7.37 106.93,8.38 106.93,9.4 106.93,10.41 106.93,11.43 105.92,1.27 104.9,1.27 103.89,1.27 102.87,1.27 101.85,1.27 100.84,1.27 99.82,1.27 98.81,1.27 97.79,1.27 96.77,1.27 70.1,25.65 71.12,25.65 72.14,25.65 73.15,25.65 38.61,25.65 39.62,25.65 40.64,25.65 41.66,25.65 35.05,114.05 36.07,114.05 37.08,114.05 38.1,114.05 66.55,114.05 67.56,114.05 68.58,114.05 69.6,114.05 87.88,137.41 87.88,136.4 87.88,135.38 87.88,134.37 87.88,133.35 87.88,132.33 87.88,131.32 87.88,130.3 87.88,129.29 87.88,128.27 87.88,127.25 87.88,126.24 87.88,125.22 87.88,124.21 87.88,123.19 87.88,122.17 87.88,121.16 87.88,120.14 87.88,119.13 87.88,118.11 87.88,117.09 87.88,116.08 87.88,115.06 87.88,114.05 87.88,113.03 87.88,112.01 87.88,111 87.88,109.98 87.88,108.97 87.88,107.95 87.88,106.93 87.88,105.92 87.88,104.9 87.88,103.89 87.88,102.87 87.88,101.85 87.88,100.84 87.88,99.82 87.88,98.81 87.88,97.79 87.88,96.77 96.77,70.36 96.77,69.34 96.77,68.33 96.77,67.31 96.77,66.29 96.77,65.28 96.77,64.26 96.77,63.25 96.77,62.23 96.77,61.21 96.77,60.2 96.77,59.18 96.77,58.17 96.77,57.15 96.77,56.13 96.77,55.12 96.77,54.1 96.77,53.09 96.77,52.07 96.77,51.05 96.77,50.04 96.77,49.02 96.77,48.01 96.77,46.99 96.77,45.97 96.77,44.96 96.77,43.94 96.77,42.93 96.77,41.91 96.77,40.89 96.77,39.88 96.77,38.86 96.77,37.85 96.77,36.83 96.77,35.81 96.77,34.8 96.77,33.78 96.77,32.77 96.77,31.75 96.77,30.73 96.77,29.72 96.77,28.7 96.77,27.69 96.77,26.67 96.77,25.65 96.77,24.64 96.77,23.62 96.77,22.61 96.77,21.59 96.77,20.57 96.77,19.56 96.77,18.54 96.77,14.48 96.77,13.46 96.77,12.45 96.77,11.43 96.77,10.41 96.77,9.4 96.77,8.38 96.77,7.37 96.77,6.35 96.77,5.33 96.77,4.32 96.77,3.3 96.77,2.29 88.34,95.69 88.65,94.73 88.97,93.76 89.28,92.8 89.59,91.83 89.91,90.86 90.22,89.9 90.54,88.93 90.85,87.96 91.16,87 91.48,86.03 91.79,85.07 92.1,84.1 92.42,83.13 92.73,82.17 93.05,81.2 93.36,80.23 93.67,79.27 93.99,78.3 94.3,77.33 94.62,76.37 94.93,75.4 95.24,74.44 95.56,73.47 95.87,72.5 96.19,71.54 20.32,2.29 20.32,3.3 20.32,4.32 20.32,5.33 20.32,6.35 20.32,7.37 20.32,8.38 20.32,9.4 20.32,10.41 20.32,11.43 20.32,12.45 20.32,13.46 20.32,14.48 20.32,15.49 20.32,16.51 20.32,17.53 20.32,18.54 20.32,19.56 20.32,20.57 20.32,21.59 20.32,22.61 20.32,23.62 20.32,24.64 20.32,25.65 20.32,26.67 20.32,27.69 20.32,28.7 20.32,29.72 20.32,30.73 20.32,31.75 20.32,32.77 20.32,33.78 20.32,34.8 20.32,35.81 20.32,36.83 20.32,37.85 20.32,38.86 20.32,39.88 20.32,40.89 20.32,41.91 20.32,42.93 11.43,69.34 11.43,70.36 11.43,71.37 11.43,72.39 11.43,73.41 11.43,74.42 11.43,75.44 11.43,76.45 11.43,77.47 11.43,78.49 11.43,79.5 11.43,80.52 11.43,81.53 11.43,82.55 11.43,83.57 11.43,84.58 11.43,85.6 11.43,86.61 11.43,87.63 11.43,88.65 11.43,89.66 11.43,90.68 11.43,91.69 11.43,92.71 11.43,93.73 11.43,94.74 11.43,95.76 11.43,96.77 11.43,97.79 11.43,98.81 11.43,99.82 11.43,100.84 11.43,101.85 11.43,102.87 11.43,103.89 11.43,104.9 11.43,105.92 11.43,106.93 11.43,107.95 11.43,108.97 11.43,109.98 11.43,111 11.43,112.01 11.43,113.03 11.43,114.05 11.43,115.06 11.43,116.08 11.43,117.09 11.43,118.11 11.43,119.13 11.43,120.14 11.43,121.16 11.43,125.22 11.43,126.24 11.43,127.25 11.43,128.27 11.43,129.29 11.43,130.3 11.43,131.32 11.43,132.33 11.43,133.35 11.43,134.37 11.43,135.38 11.43,136.4 11.43,137.41 19.87,44.01 19.55,44.97 19.24,45.94 18.92,46.9 18.61,47.87 18.3,48.84 17.98,49.8 17.67,50.77 17.35,51.74 17.04,52.7 16.73,53.67 16.41,54.63 16.1,55.6 15.79,56.57 15.47,57.53 15.16,58.5 14.84,59.47 14.53,60.43 14.22,61.4 13.9,62.37 13.59,63.33 13.27,64.3 12.96,65.26 12.65,66.23 12.33,67.2 12.02,68.16
  pour Bottom (isolate 0.61, rank 2): 0,0 108.2,0 108.2,139.7 0,139.7
  pour Top (isolate 0.61): 29.97,0.25 44.7,0.25 44.7,7.62 29.97,7.62
  pour Top (isolate 0.61): 44.96,0.25 59.69,0.25 59.69,7.62 44.96,7.62
  pour Top (isolate 0.61): 61.47,0.25 76.2,0.25 76.2,7.62 61.47,7.62
  pour Top (isolate 0.61): 76.45,0.25 91.19,0.25 91.19,7.62 76.45,7.62
  pour Top (isolate 0.61): 46.74,139.19 32,139.19 32,132.08 46.74,132.08
  pour Top (isolate 0.61): 31.75,139.19 17.02,139.19 17.02,132.08 31.75,132.08
  pour Top (isolate 0.61): 78.23,139.19 63.5,139.19 63.5,132.08 78.23,132.08
  pour Top (isolate 0.61): 63.25,139.19 48.51,139.19 48.51,132.08 63.25,132.08
  pour Top (isolate 0.61, rank 6): 0,0 108.2,0 108.2,139.7 0,139.7
N$1
  Top 0.711: IC1.2 38.35,51.08 PD1.C
N$2
  Top 0.406: C5.1 38.99,34.42
  Top 0.711: 38.99,34.42 38.35,35.05 IC1.7
N$3
  Top 0.711: C2.2 40.85,39.97 40.01,39.12 36.58,39.12 35.81,39.88 IC1.4
N$4
  Top 0.406: C4.1 36.45,34.42
  Top 0.711: 36.45,34.42 37.08,35.05 IC1.6
N$5
  Top 0.406: 36.41,32.64 C4.2
  Top 0.711: R2.2 36.41,32.64 36.41,32.09 35.81,31.5 U$1.6
N$6
  Top 0.406: 40.64,32.68 R1.1
  Top 0.711: 40.64,32.68 C5.2 38.99,32.13 39.62,31.5 U$1.3
N$7
  Top 0.406: 38.35,27.43 U$1.4
  Top 0.711: R3.1 38.57,29.68 38.35,29.46 U$1.4
N$8
  Top 0.711: R3.2 36.87,29.68 37.08,29.46 U$1.5
N$9
  Top 0.711: R4.1 39.2,21.42 39.62,21.84 U$1.12
N$10
  Top 0.711: C13.1 R4.2 | R4.2 37.5,21.17 37.08,21.59 U$1.10 | R33.2 R4.2
N$11
  Top 0.711: R6.2 34.42,15.94 | 34.42,15.94 U$6.4 | R5.1 32.85,15.84 32.96,15.94 34.42,15.94
N$12
  Top 0.711: C13.2 34.46,19.24 R6.1
N$13  (via drill 0.6)
  Top 0.711: U$1.2 40.89,30.23 v41.4,30.73 | U$2.2 U$4.2
  Bottom 0.711: v41.4,30.73 42.42,30.73 46.23,34.54 U$2.2
N$14
  Top 0.711: R8.2 U$5.2
N$15
  Top 0.711: U$6.3 39.47,15.94 R7.1
N$16
  Top 0.711: 36.83,12.7 32.51,12.7 31.5,13.72 R5.2 | 36.83,12.7 37.34,12.7 | U$6.1 38.56,12.9 38.35,12.7 37.85,12.7 | 37.85,12.7 37.34,12.7 | 37.34,12.7 37.34,12.19 | 37.34,12.19 R8.1 | 37.34,12.19 36.83,12.7 | 37.34,12.19 37.85,12.7
N$18
  cutout Bottom: 35.05,35.05 40.39,35.05 40.39,38.1 35.05,38.1
  cutout Bottom: 35.05,40.13 40.39,40.13 40.39,43.18 35.05,43.18
  cutout Bottom: 42.93,26.42 33.78,26.42 33.78,29.72 42.93,29.72
  cutout Bottom: 42.93,20.32 33.78,20.32 33.78,24.89 42.93,24.89
  cutout Top: 39.62,12.7 35.05,12.7 35.05,16.76 39.62,16.76
N$19
  cutout Top: 34.29,5.59 34.29,0.51 36.07,0.51 36.07,5.59
N$20
  cutout Top: 34.29,8.13 34.29,0.51 36.07,0.51 36.07,8.13
  cutout Bottom: 39.12,12.19 29.97,12.19 29.97,14.22 39.12,14.22
N$21
  cutout Top: 38.61,8.13 38.61,0.51 40.39,0.51 40.39,8.13
N$22
  cutout Top: 49.28,7.62 49.28,0.51 51.05,0.51 51.05,7.62
N$23
  cutout Top: 53.59,8.13 53.59,0.51 55.37,0.51 55.37,8.13
N$25
  Top 0.711: C18.2 72.35,39.97 71.5,39.12 68.07,39.12 67.31,39.88 IC2.4
N$26
  Top 0.711: IC2.2 69.85,51.08 PD2.C
N$27
  Top 0.406: C21.1 70.48,34.42
  Top 0.711: 70.48,34.42 69.85,35.05 IC2.7
N$28
  Top 0.406: C20.1 67.94,34.42
  Top 0.711: 67.94,34.42 68.58,35.05 IC2.6
N$29
  Top 0.406: 67.91,32.64 C20.2
  Top 0.711: R10.2 67.91,32.64 67.91,32.09 67.31,31.5 U$7.6
N$30
  Top 0.406: 72.14,32.68 R9.1
  Top 0.711: 72.14,32.68 C21.2 70.48,32.13 71.12,31.5 U$7.3
N$31
  Top 0.406: 69.85,27.43 U$7.4
  Top 0.711: R11.1 70.06,29.68 69.85,29.46 U$7.4
N$32
  Top 0.711: R11.2 68.36,29.68 68.58,29.46 U$7.5
N$33
  Top 0.711: R12.1 70.7,21.42 71.12,21.84 U$7.12
N$34
  Top 0.711: C28.1 R12.2 | R12.2 69,21.17 68.58,21.59 U$7.10 | R36.2 R12.2
N$35
  Top 0.711: C28.2 65.95,19.24 R13.1
N$36  (via drill 0.6)
  Top 0.711: U$7.2 72.39,30.23 v72.9,30.73 | U$8.2 U$9.2
  Bottom 0.711: v72.9,30.73 73.91,30.73 77.72,34.54 U$8.2
N$37
  Top 0.711: R13.2 65.91,15.94 | 65.91,15.94 U$11.4 | R14.1 64.35,15.84 64.45,15.94 65.91,15.94
N$38
  Top 0.711: U$11.3 70.97,15.94 R15.1
N$39
  Top 0.711: 68.33,12.7 64.01,12.7 62.99,13.72 R14.2 | 68.33,12.7 68.83,12.7 | U$11.1 70.05,12.9 69.85,12.7 69.34,12.7 | 69.34,12.7 68.83,12.7 | 68.83,12.7 68.83,12.19 | 68.83,12.19 R16.1 | 68.83,12.19 68.33,12.7 | 68.83,12.19 69.34,12.7
N$40
  Top 0.711: R16.2 U$10.2
N$41
  cutout Bottom: 66.55,35.05 71.88,35.05 71.88,38.1 66.55,38.1
  cutout Bottom: 66.55,40.13 71.88,40.13 71.88,43.18 66.55,43.18
  cutout Bottom: 74.42,26.42 65.28,26.42 65.28,29.72 74.42,29.72
  cutout Bottom: 74.42,20.32 65.28,20.32 65.28,24.89 74.42,24.89 74.42,21.84
  cutout Top: 71.12,12.7 66.55,12.7 66.55,16.76 71.12,16.76
N$42
  cutout Top: 65.79,5.59 65.79,0.51 67.56,0.51 67.56,5.59
N$43
  cutout Top: 65.79,8.13 65.79,0.51 67.56,0.51 67.56,8.13
  cutout Bottom: 70.61,12.19 61.47,12.19 61.47,14.22 70.61,14.22
N$44
  cutout Top: 70.1,8.13 70.1,0.51 71.88,0.51 71.88,8.13
N$45
  cutout Top: 80.77,8.13 80.77,0.51 82.55,0.51 82.55,8.13
N$46
  cutout Top: 85.09,8.13 85.09,0.51 86.87,0.51 86.87,8.13
N$47
  Top 0.711: C34.2 35.85,99.73 36.7,100.58 40.13,100.58 40.89,99.82 IC3.4
N$48
  Top 0.711: IC3.2 38.35,88.62 PD3.C
N$49
  Top 0.406: C37.1 37.72,105.28
  Top 0.711: 37.72,105.28 38.35,104.65 IC3.7
N$50
  Top 0.406: C36.1 40.26,105.28
  Top 0.711: 40.26,105.28 39.62,104.65 IC3.6
N$51
  Top 0.406: 40.3,107.06 C36.2
  Top 0.711: R18.2 40.3,107.06 40.3,107.61 40.89,108.2 U$12.6
N$52
  Top 0.406: 36.07,107.02 R17.1
  Top 0.711: 36.07,107.02 C37.2 37.72,107.57 37.08,108.2 U$12.3
N$53
  Top 0.406: 38.35,112.27 U$12.4
  Top 0.711: R19.1 38.14,110.02 38.35,110.24 U$12.4
N$54
  Top 0.711: R19.2 39.84,110.02 39.62,110.24 U$12.5
N$55
  Top 0.711: R20.1 37.5,118.28 37.08,117.86 U$12.12
N$56
  Top 0.711: C44.1 R20.2 | R20.2 39.2,118.53 39.62,118.11 U$12.10 | R35.2 R20.2
N$57
  Top 0.711: C44.2 42.25,120.46 R21.1
N$58  (via drill 0.6)
  Top 0.711: U$12.2 35.81,109.47 v35.31,108.97 | U$13.2 U$14.2
  Bottom 0.711: v35.31,108.97 34.29,108.97 30.48,105.16 U$13.2
N$59
  Top 0.711: R21.2 42.29,123.76 | 42.29,123.76 U$16.4 | R22.1 43.85,123.86 43.75,123.76 42.29,123.76
N$60
  Top 0.711: U$16.3 37.24,123.76 R23.1
N$61
  Top 0.711: 39.88,127 44.2,127 45.21,125.98 R22.2 | 39.88,127 39.37,127 | U$16.1 38.15,126.8 38.35,127 38.86,127 | 38.86,127 39.37,127 | 39.37,127 39.37,127.51 | 39.37,127.51 R24.1 | 39.37,127.51 39.88,127 | 39.37,127.51 38.86,127
N$62
  Top 0.711: R24.2 U$15.2
N$63
  cutout Bottom: 41.66,104.65 36.32,104.65 36.32,101.6 41.66,101.6
  cutout Bottom: 41.66,99.57 36.32,99.57 36.32,96.52 41.66,96.52
  cutout Bottom: 33.78,113.28 42.93,113.28 42.93,109.98 33.78,109.98
  cutout Bottom: 33.78,119.38 42.93,119.38 42.93,114.81 33.78,114.81
  cutout Top: 37.08,127 41.66,127 41.66,122.94 37.08,122.94
N$64
  cutout Top: 42.42,134.11 42.42,139.19 40.64,139.19 40.64,134.11
N$65
  cutout Top: 42.42,131.57 42.42,139.19 40.64,139.19 40.64,131.57
  cutout Bottom: 37.59,127.51 46.74,127.51 46.74,125.48 37.59,125.48
N$66
  cutout Top: 38.1,131.57 38.1,139.19 36.32,139.19 36.32,131.57
N$67
  cutout Top: 27.43,131.57 27.43,139.19 25.65,139.19 25.65,131.57
N$68
  cutout Top: 23.11,131.57 23.11,139.19 21.34,139.19 21.34,131.57
N$69
  Top 0.711: C50.2 67.35,99.73 68.2,100.58 71.63,100.58 72.39,99.82 IC4.4
N$70
  Top 0.711: IC4.2 69.85,88.62 PD4.C
N$71
  Top 0.406: C53.1 69.22,105.28
  Top 0.711: 69.22,105.28 69.85,104.65 IC4.7
N$72
  Top 0.406: C52.1 71.75,105.28
  Top 0.711: 71.75,105.28 71.12,104.65 IC4.6
N$73
  Top 0.406: 71.79,107.06 C52.2
  Top 0.711: R26.2 71.79,107.06 71.79,107.61 72.39,108.2 U$17.6
N$74
  Top 0.406: 67.56,107.02 R25.1
  Top 0.711: 67.56,107.02 C53.2 69.22,107.57 68.58,108.2 U$17.3
N$75
  Top 0.406: 69.85,112.27 U$17.4
  Top 0.711: R27.1 69.64,110.02 69.85,110.24 U$17.4
N$76
  Top 0.711: R27.2 71.33,110.02 71.12,110.24 U$17.5
N$77
  Top 0.711: R28.1 69,118.28 68.58,117.86 U$17.12
N$78
  Top 0.711: C60.1 R28.2 | R28.2 70.7,118.53 71.12,118.11 U$17.10 | R28.2 R34.2
N$79
  Top 0.711: C60.2 73.75,120.46 R29.1
N$80  (via drill 0.6)
  Top 0.711: U$17.2 67.31,109.47 v66.8,108.97 | U$18.2 U$19.2
  Bottom 0.711: v66.8,108.97 65.79,108.97 61.98,105.16 U$18.2
N$81
  Top 0.711: R29.2 73.79,123.76 | 73.79,123.76 U$21.4 | R30.1 75.35,123.86 75.25,123.76 73.79,123.76
N$82
  Top 0.711: U$21.3 68.73,123.76 R31.1
N$83
  Top 0.711: 71.37,127 75.69,127 76.71,125.98 R30.2 | 71.37,127 70.87,127 | U$21.1 69.65,126.8 69.85,127 70.36,127 | 70.36,127 70.87,127 | 70.87,127 70.87,127.51 | 70.87,127.51 R32.1 | 70.87,127.51 71.37,127 | 70.87,127.51 70.36,127
N$84
  Top 0.711: R32.2 U$20.2
N$85
  cutout Bottom: 73.15,104.65 67.82,104.65 67.82,101.6 73.15,101.6
  cutout Bottom: 73.15,99.57 67.82,99.57 67.82,96.52 73.15,96.52
  cutout Bottom: 65.28,113.28 74.42,113.28 74.42,109.98 65.28,109.98
  cutout Bottom: 65.28,119.38 74.42,119.38 74.42,114.81 65.28,114.81
  cutout Top: 68.58,127 73.15,127 73.15,122.94 68.58,122.94
N$86
  cutout Top: 73.91,134.11 73.91,139.19 72.14,139.19 72.14,134.11
N$87
  cutout Top: 73.91,131.57 73.91,139.19 72.14,139.19 72.14,131.57
  cutout Bottom: 69.09,127.51 78.23,127.51 78.23,125.48 69.09,125.48
N$88
  cutout Top: 69.6,131.57 69.6,139.19 67.82,139.19 67.82,131.57
N$89
  cutout Top: 58.93,132.08 58.93,139.19 57.15,139.19 57.15,132.08
N$90
  cutout Top: 54.61,131.57 54.61,139.19 52.83,139.19 52.83,131.57
N$91
  Top 0.711: R33.1 C65.1
N$93
  Top 0.711: R34.1 C66.1
N$95
  Top 0.711: R35.1 C67.1
N$97
  Top 0.711: R36.1 C68.1

### Text on the board
tPlace: GND | +5V | -5V | +5V | -5V | -5V | -5V | -5V | -5V | -5V | +5V | -5V | +5V | GND